# Altium schematic sheet A4_costomTemplate.SchDoc: Add title
size A4; Author: Draš Kunšič; Revision: 1; SheetNumber: x; SheetTotal: y; DocumentTitle: Document
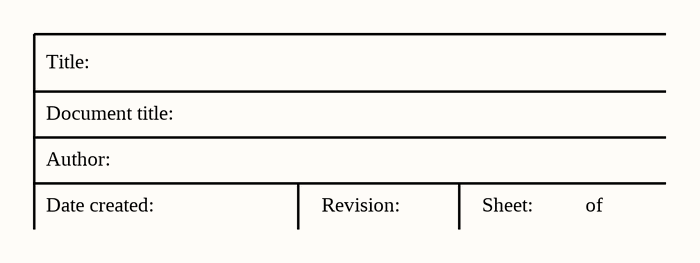
[diagram p0: A4_costomTemplate.SchDoc]

## Notes on the sheet
- Title:
- Author:
- Document title:
- Date created:
- Revision:
- Sheet:
- of